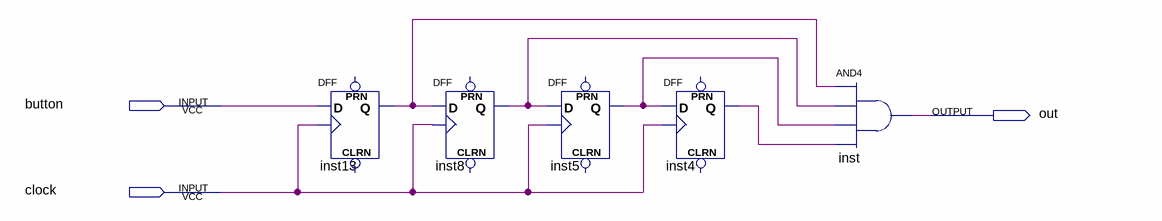
[diagram p0: schematic sheet]
// Quartus schematic Debouncer.bdf as structural Verilog: 5 symbols, 3 pins
module Debouncer (
  input  button,
  input  clock,
  output out
);

  wire inst4_q, inst5_q, inst8_q, inst13_q;

  DFF inst13 (.CLK(clock), .D(button), .Q(inst13_q));  // open: CLRN, PRN
  DFF inst8 (.CLK(clock), .D(inst13_q), .Q(inst8_q));  // open: CLRN, PRN
  DFF inst5 (.CLK(clock), .D(inst8_q), .Q(inst5_q));  // open: CLRN, PRN
  DFF inst4 (.CLK(clock), .D(inst5_q), .Q(inst4_q));  // open: CLRN, PRN
  and inst (out, inst13_q, inst8_q, inst5_q, inst4_q);
endmodule
